# Altium project RS485 Gateway.PrjPcb
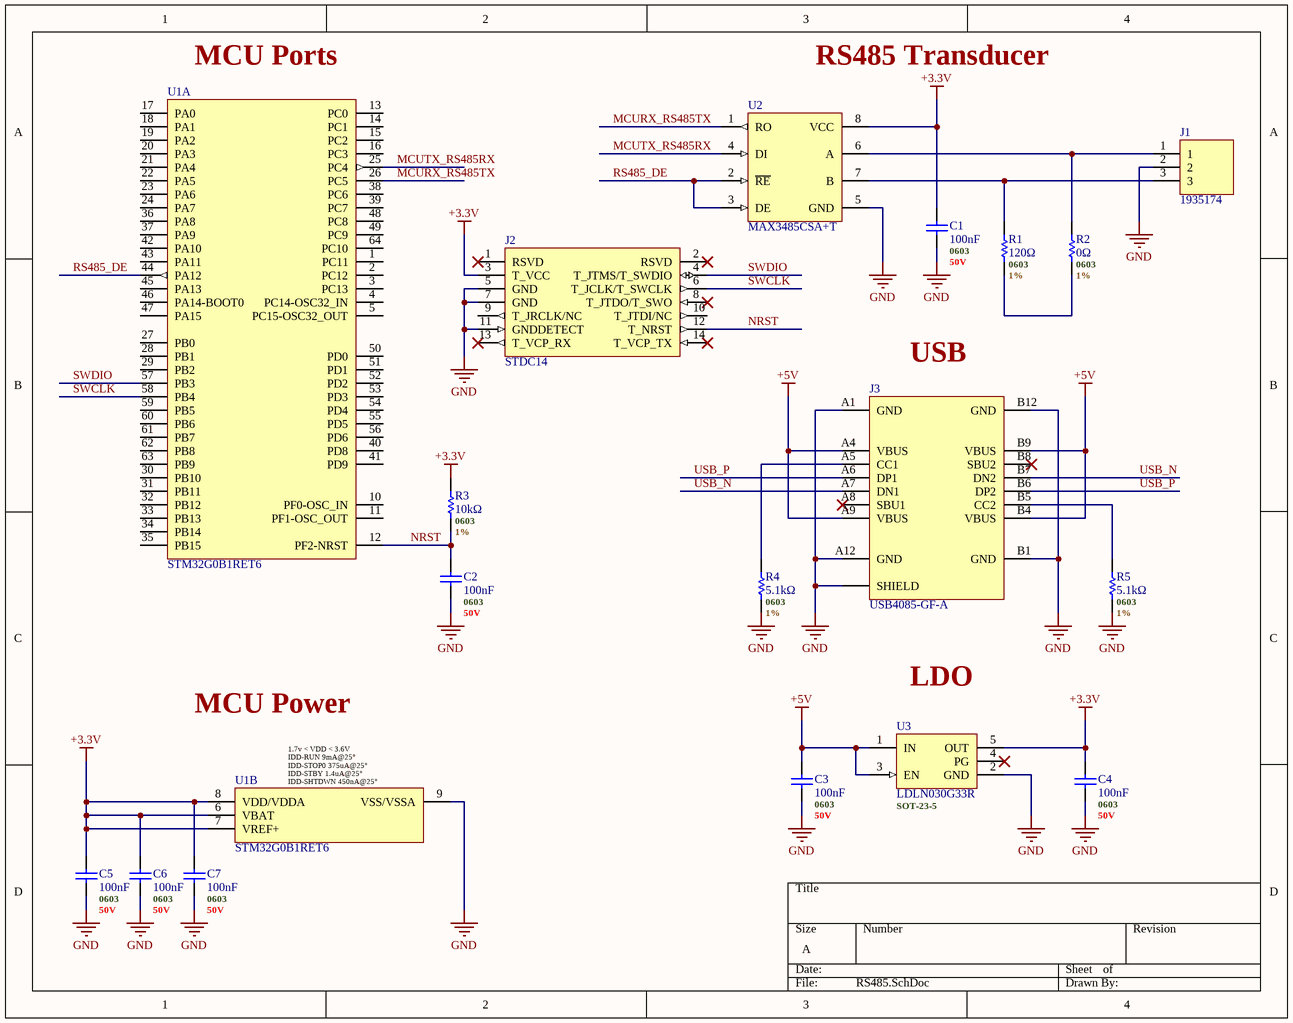
[diagram p0: RS485.SchDoc]
1 sheet, 18 parts. Net scope: global (net labels, ports and power ports of the same name join across sheets).
Board file: PCB2.PcbDoc

## Sheet RS485.SchDoc
size A; SheetNumber: 1; SheetTotal: 1

### Parts
C1  100nF  .Case/Package: 0603  .Rated DC Voltage (URdc): 50V  [C0402 - MURATA]
C2  100nF  .Case/Package: 0603  .Rated DC Voltage (URdc): 50V  [C0402 - MURATA]
C3  100nF  .Case/Package: 0603  .Rated DC Voltage (URdc): 50V  [C0402 - MURATA]
C4  100nF  .Case/Package: 0603  .Rated DC Voltage (URdc): 50V  [C0402 - MURATA]
C5  100nF  .Case/Package: 0603  .Rated DC Voltage (URdc): 50V  [C0402 - MURATA]
C6  100nF  .Case/Package: 0603  .Rated DC Voltage (URdc): 50V  [C0402 - MURATA]
C7  100nF  .Case/Package: 0603  .Rated DC Voltage (URdc): 50V  [C0402 - MURATA]
J1  1935174  [1935174 - PHOENIX]
J2  STDC14  [FTSH-107-01-L-DV-K-P-TR]
J3  USB4085-GF-A  [USB4085-GF-A - GCT - 071422]
R1  120Ω  .Case/Package: 0603  .Tolerance: 1%  [R0603 - YAGEO]
R2  0Ω  .Case/Package: 0603  .Tolerance: 1%  [R0603 - YAGEO]
R3  10kΩ  .Case/Package: 0603  .Tolerance: 1%  [R0603 - YAGEO]
R4  5.1kΩ  .Case/Package: 0603  .Tolerance: 1%  [R0603 - YAGEO]
R5  5.1kΩ  .Case/Package: 0603  .Tolerance: 1%  [R0603 - YAGEO]
U1  STM32G0B1RET6  [64-LQFP - STM]  (parts A,B of 2)
U2  MAX3485CSA+T  [8-SOIC - ANALOG]
U3  LDLN030G33R  .Case/Package: SOT-23-5  [TSOT-23-5 - STM]

### Nets
+3.3V: C1.2 C4.2 C5.2 C6.2 C7.2 J2.3(T_VCC) R3.2 U1.6(VBAT) U1.7(VREF+) U1.8(VDD/VDDA) U2.8(VCC) U3.5(OUT)
+5V: C3.2 J3.A4(VBUS) J3.A9(VBUS) J3.B4(VBUS) J3.B9(VBUS) U3.1(IN) U3.3(EN)
GND: C1.1 C2.1 C3.1 C4.1 C5.1 C6.1 C7.1 J1.2 J2.5(GND) J2.7(GND) J2.11(GNDDETECT) J3.A1(GND) J3.A12(GND) J3.B1(GND) J3.B12(GND) J3.SHIELD R4.1 R5.1 U1.9(VSS/VSSA) U2.5(GND) U3.2(GND)
MCURX_RS485TX: U1.26(PC5) U2.1(RO)
MCUTX_RS485RX: U1.25(PC4) U2.4(DI)
NRST: C2.2 J2.12(T_NRST) R3.1 U1.12(PF2-NRST)
RS485_DE: U1.44(PA12) U2.2(~{RE}) U2.3(DE)
SWCLK: J2.6(T_JCLK/T_SWCLK) U1.58(PB4)
SWDIO: J2.4(T_JTMS/T_SWDIO) U1.57(PB3)
USB_N: J3.A7(DN1) J3.B7(DN2)
USB_P: J3.A6(DP1) J3.B6(DP2)
NetJ1_1: J1.1 R2.2 U2.6(A)
NetJ1_3: J1.3 R1.2 U2.7(B)
NetJ3_A5: J3.A5(CC1) R4.2
NetJ3_B5: J3.B5(CC2) R5.2
NetR1_1: R1.1 R2.1

Not connected (* = marked no-connect by the designer): J2 1(RSVD)* 2(RSVD)* 8(T_JTDO/T_SWO)* 9(T_JRCLK/NC) 10(T_JTDI/NC) 13(T_VCP_RX)* 14(T_VCP_TX)*; J3 A8(SBU1)* B8(SBU2)*; U1 1(PC11) 2(PC12) 3(PC13) 4(PC14-OSC32_IN) 5(PC15-OSC32_OUT) 10(PF0-OSC_IN) 11(PF1-OSC_OUT) 13(PC0) 14(PC1) 15(PC2) 16(PC3) 17(PA0) 18(PA1) 19(PA2) 20(PA3) 21(PA4) 22(PA5) 23(PA6) 24(PA7) 27(PB0) 28(PB1) 29(PB2) 30(PB10) 31(PB11) 32(PB12) 33(PB13) 34(PB14) 35(PB15) 36(PA8) 37(PA9) 38(PC6) 39(PC7) 40(PD8) 41(PD9) 42(PA10) 43(PA11) 45(PA13) 46(PA14-BOOT0) 47(PA15) 48(PC8) 49(PC9) 50(PD0) 51(PD1) 52(PD2) 53(PD3) 54(PD4) 55(PD5) 56(PD6) 59(PB5) 60(PB6) 61(PB7) 62(PB8) 63(PB9) 64(PC10); U3 4(PG)*

### Notes on the sheet
- (near U1) MCU Ports
- RS485 Transducer
- (near J3) USB
- LDO
- MCU Power
- (in symbol STM32G0B1RET6, part B) 1.7v < VDD < 3.6V / IDD-RUN 9mA@25° / IDD-STOP0 375uA@25° / IDD-STBY 1.4uA@25° / IDD-SHTDWN 450nA@25°

### Library data of the parts
C1-C7 = CAP - GENERIC: Cap Ceramic 0.1uF 50V X7R 10% Pad SMD 0603 Soft Termination 125C Automotive T/R; Manufacturer: Murata; Manufacturer Part Number: GCJ188R71H104KA12D; Manufacturer Lifecycle Status: IN PRODUCTION; .Date: 050525; Supplier: Avnet; Supplier Part Number: GCJ188R71H104KA12D; RoHS: Compliant; Category: Ceramic Capacitors; Stock: 204000; Pricing: 4000=0.01499 (USD); Value: 100nF; Case/Package: 0603; Case Code (Imperial): 0603; Case Code (Metric): 1608; Depth: 800µm; Dielectric: X7R; Dielectric Material: Ceramic; Features: Soft Termination; Height: 800µm; Lead Free: Lead Free; Length: 1.6mm; Lifecycle Status: Production; Material: Ceramic; Max Operating Temperature: 125°C; Min Operating Temperature: -55°C; Mounting Technology: Surface Mount; Number of Terminals: 2; Packaging: Cut Tape; Radiation Hardening: No; Ratings: AEC-Q200; REACH SVHC: Yes; Schedule B: 8532240020, 8532240020|8532240020, 8532240020|8532240020|8532240020, 8532240020|8532240020|8532240020|8532240020; Termination: SMD/SMT; Tolerance: 10%; Voltage Rating: 50V; Voltage Rating (DC): 50V; Width: 800µm; ComponentLink1URL: https://datasheet.octopart.com:443/GCJ188R71H104KA12D-Murata-datasheet-68586835.pdf?src-supplier=Newark; ComponentLink1Description: https://datasheet.octopart.com:443/GCJ188R71H104KA12D-Murata-datasheet-68586835.pdf?src-supplier=Newark; ComponentLink2URL: https://datasheet.octopart.com:443/GCJ188R71H104KA12D-Murata-datasheet-140654765.pdf?src-supplier=Ciiva; ComponentLink2Description: https://datasheet.octopart.com:443/GCJ188R71H104KA12D-Murata-datasheet-140654765.pdf?src-supplier=Ciiva; ComponentLink3URL: https://datasheet.octopart.com:443/GCJ188R71H104KA12D-Murata-datasheet-138714437.pdf?src-supplier=Ciiva; ComponentLink3Description: https://datasheet.octopart.com:443/GCJ188R71H104KA12D-Murata-datasheet-138714437.pdf?src-supplier=Ciiva; ComponentLink4URL: https://datasheet.octopart.com:443/GCJ188R71H104KA12D-Murata-datasheet-165611796.pdf?src-supplier=TME; ComponentLink4Description: https://datasheet.octopart.com:443/GCJ188R71H104KA12D-Murata-datasheet-165611796.pdf?src-supplier=TME; ComponentLink5URL: https://datasheet.octopart.com:443/GCJ188R71H104KA12D-Murata-datasheet-12524712.pdf?src-supplier=Future+Electronics; ComponentLink5Description: https://datasheet.octopart.com:443/GCJ188R71H104KA12D-Murata-datasheet-12524712.pdf?src-supplier=Future+Electronics; ComponentLink6URL: https://datasheet.octopart.com/GCJ188R71H104KA12D-Murata-datasheet-14405607.pdf; ComponentLink6Description: https://datasheet.octopart.com/GCJ188R71H104KA12D-Murata-datasheet-14405607.pdf; ComponentLink7URL: http://sigma.octopart.com:80/reach_statement/Murata-company-16.pdf?src-supplier=Compliance+Statements; ComponentLink7Description: http://sigma.octopart.com:80/reach_statement/Murata-company-16.pdf?src-supplier=Compliance+Statements; Supplier 1: DigiKey; Supplier Part Number 1: 490-5798-6-ND
J1 = CONN 1X3: Terminal Block; Printed Circuit; 16 A; 250 V; 5 mm; 3; 5 mm; Soldering Mount; Manufacturer: Phoenix Contact; Approvals: UL; Current: 18A; Current Rating: 17.5A; Max Current Rating: 16A; Max Supply Voltage: 250V; Number of Circuits: 3; Number of Levels: 1; Pitch: 5mm; Voltage: 300V; Voltage Rating (DC): 320V; Wire/Cable Gauge: 14AWG; Wire Gauge (Max): 26AWG; Wire Gauge (Min): 12AWG; Supplier: RS (Formerly Allied Electronics); Supplier Part Number: 70054333; Manufacturer Part Number: 1935174; RoHS: Compliant; Category: Terminal Blocks; Stock: 132; Pricing: 1=0.74 (USD); Ambient Temperature Range High: 100°C; China RoHS: Non-Compliant; Color: Green; Contact Material: Nickel, Tin; Contact Plating: Tin; Depth: 9mm; Flammability Rating: UL94 V-0; Height: 11.55mm; Housing Color: Green; Insulation Material: Nylon; Lead Free: Lead Free; Length: 9mm; Lifecycle Status: Production; Material: Nylon; Max Operating Temperature: 100°C; Min Operating Temperature: -40°C; Mounting Technology: Screw; Number of Contacts: 3; Pins: 3; Number of Poles: 3; Number of Positions: 3; Number of Positions Per Level: 3; Number of Rows: 1; Orientation: Straight; Radiation Hardening: No; REACH SVHC: No; Stripping Length: 5mm; Termination: Solder; Thickness: 10mm; Voltage Rating: 250V; Weight: 2.850006g; Width: 15mm; ComponentLink1URL: https://datasheet.octopart.com:443/1935174-Phoenix-Contact-datasheet-181093233.pdf?src-supplier=IHS; ComponentLink1Description: https://datasheet.octopart.com:443/1935174-Phoenix-Contact-datasheet-181093233.pdf?src-supplier=IHS; ComponentLink2URL: https://datasheet.octopart.com:443/1935174-Phoenix-Contact-datasheet-86451116.pdf?src-supplier=Farnell; ComponentLink2Description: https://datasheet.octopart.com:443/1935174-Phoenix-Contact-datasheet-86451116.pdf?src-supplier=Farnell; ComponentLink3URL: https://datasheet.octopart.com:443/PT1%2C5/3-5.0-H-Phoenix-Contact-datasheet-8825747.pdf?src-supplier=element14+APAC; ComponentLink3Description: https://datasheet.octopart.com:443/PT1%2C5/3-5.0-H-Phoenix-Contact-datasheet-8825747.pdf?src-supplier=element14+APAC; ComponentLink4URL: https://datasheet.octopart.com:443/1935174-Phoenix-Contact-datasheet-154783735.pdf?src-supplier=Electro+Sonic; ComponentLink4Description: https://datasheet.octopart.com:443/1935174-Phoenix-Contact-datasheet-154783735.pdf?src-supplier=Electro+Sonic; ComponentLink5URL: https://datasheet.octopart.com:443/1935174-Phoenix-Contact-datasheet-62123024.pdf?src-supplier=RS+(Formerly+Allied+Electronics); ComponentLink5Description: https://datasheet.octopart.com:443/1935174-Phoenix-Contact-datasheet-62123024.pdf?src-supplier=RS+(Formerly+Allied+Electronics); ComponentLink6URL: https://datasheet.octopart.com:443/1935174-Phoenix-Contact-datasheet-9933183.pdf?src-supplier=RS+(Formerly+Allied+Electronics); ComponentLink6Description: https://datasheet.octopart.com:443/1935174-Phoenix-Contact-datasheet-9933183.pdf?src-supplier=RS+(Formerly+Allied+Electronics); ComponentLink7URL: https://datasheet.octopart.com:443/1935174-Phoenix-Contact-datasheet-72435.pdf?src-supplier=RS+(Formerly+Allied+Electronics); ComponentLink7Description: https://datasheet.octopart.com:443/1935174-Phoenix-Contact-datasheet-72435.pdf?src-supplier=RS+(Formerly+Allied+Electronics); ComponentLink8URL: https://datasheet.octopart.com:443/1935174-Phoenix-Contact-datasheet-33522581.pdf?src-supplier=MRO+Stop; ComponentLink8Description: https://datasheet.octopart.com:443/1935174-Phoenix-Contact-datasheet-33522581.pdf?src-supplier=MRO+Stop; ComponentLink9URL: https://datasheet.octopart.com:443/1935174-Phoenix-Contact-datasheet-54829.pdf?src-supplier=DigiKey; ComponentLink9Description: https://datasheet.octopart.com:443/1935174-Phoenix-Contact-datasheet-54829.pdf?src-supplier=DigiKey; ComponentLink10URL: https://datasheet.octopart.com:443/1935174-Phoenix-Contact-datasheet-164875068.pdf?src-supplier=Burklin+Elektronik; ComponentLink10Description: https://datasheet.octopart.com:443/1935174-Phoenix-Contact-datasheet-164875068.pdf?src-supplier=Burklin+Elektronik; Supplier 1: DigiKey; Supplier Part Number 1: 277-1578-ND
J2 = STDC14: Manufacturer: Samtec; Number of Contacts: 14; Gender: Male; Pitch: 1.27mm; Manufacturer Part Number: FTSH-107-01-L-DV-K-P-TR; RoHS: Yes; Category: Headers and Wire Housings; Stock 1: 404; Pricing 1: 1=4.81000, 10=4.62000, 100=3.85000 (USD); Contact Plating: Gold; Housing Material: Polymer; Housing Color: Black; Contact Material: Bronze; Min Operating Temperature: -55°C; Max Operating Temperature: 125°C; Termination: Solder; Number of Rows: 2; Orientation: Straight; Packaging: Tape and Reel; Length: 8.89mm; Depth: 3.43mm; Radiation Hardening: No; Lead Free: Lead Free; Supplier 1: DigiKey; Supplier Part Number 1: SAM13946CT-ND
J3 = USB4085-GF-A: USB4085 Series 20 V PCB Top Mount USB 2.0 Type C Receptacle; Manufacturer: Global Connector Technology; USB Standard: USB 2.0; Number of Positions: 16; Supplier 1: Digi-Key; Supplier Part Number 1: 2073-USB4085-GF-ACT-ND; Manufacturer Part Number: USB4085-GF-A; RoHS: Yes; Category: USB Connectors; Stock 1: 30576; Contact Material: Copper Alloy; Contact Plating: Gold; Gender: Receptacle; Orientation: Right Angle; ComponentLink1URL: https://datasheet.ciiva.com/71788/2674755-71788146.pdf?src-supplier=Element14; ComponentLink1Description: https://datasheet.ciiva.com/71788/2674755-71788146.pdf?src-supplier=Element14; ComponentLink2URL: https://datasheet.ciiva.com/71788/usb4085-71788147.pdf?src-supplier=Digi-Key; ComponentLink2Description: https://datasheet.ciiva.com/71788/usb4085-71788147.pdf?src-supplier=Digi-Key
R1 = RESISTOR - GENERIC: Res Thick Film 0603 120 Ohm 1% 0.1W(1/10W) ±100ppm/C Pad SMD T/R; Manufacturer: Yageo Group; Manufacturer Part Number: RC0603FR-10120RL; Power Dissipation: 100mW; Temperature Coefficient: 100ppm/°C; Voltage Rating: 50V; Working Voltage: 75V; Supplier: Newark; Supplier Part Number: 47AK3870; RoHS: Compliant; Category: Chip SMD Resistors; Stock: 7940; Pricing: 10=0.010, 25=0.009, 50=0.009, 100=0.008, 500=0.007, 1000=0.006, 5000=0.005 (USD); Case/Package: 0603; Case Code (Imperial): 0603; Case Code (Metric): 1608; China RoHS: Non-Compliant; Composition: Thick Film; Contact Plating: Tin; Depth: 800µm; Height: 450µm; Length: 1.6mm; Lifecycle Status: Production; Max Operating Temperature: 155°C; Military Standard: Not; Min Operating Temperature: -55°C; Mounting Technology: Surface Mount; Number of Terminals: 2; Power Rating: 100mW; Radiation Hardening: No; REACH SVHC: Yes; Value: 120Ω; Termination: SMD/SMT; Tolerance: 1%; Width: 800µm; ComponentLink1URL: https://datasheet.octopart.com:443/RC0603FR-10120RL-Yageo-datasheet-175887523.pdf?src-supplier=IHS; ComponentLink1Description: https://datasheet.octopart.com:443/RC0603FR-10120RL-Yageo-datasheet-175887523.pdf?src-supplier=IHS; ComponentLink2URL: https://datasheet.octopart.com:443/RC0603FR-10120RL-Yageo-datasheet-164759695.pdf?src-supplier=Future+Electronics; ComponentLink2Description: https://datasheet.octopart.com:443/RC0603FR-10120RL-Yageo-datasheet-164759695.pdf?src-supplier=Future+Electronics; ComponentLink3URL: https://datasheet.octopart.com:443/RC0603FR-10120RL-Yageo-datasheet-137700087.pdf?src-supplier=Future+Electronics; ComponentLink3Description: https://datasheet.octopart.com:443/RC0603FR-10120RL-Yageo-datasheet-137700087.pdf?src-supplier=Future+Electronics; ComponentLink4URL: https://datasheet.octopart.com/RC0603FR-10120RL-Yageo-datasheet-73766026.pdf; ComponentLink4Description: https://datasheet.octopart.com/RC0603FR-10120RL-Yageo-datasheet-73766026.pdf; ComponentLink5URL: https://datasheet.octopart.com:443/RC0603FR-10120RL-Yageo-datasheet-8328172.pdf?src-supplier=_legacy+Avnet; ComponentLink5Description: https://datasheet.octopart.com:443/RC0603FR-10120RL-Yageo-datasheet-8328172.pdf?src-supplier=_legacy+Avnet; ComponentLink6URL: http://sigma.octopart.com:80/conflict_mineral_statement/Yageo-company-3.pdf?src-supplier=Compliance+Statements; ComponentLink6Description: http://sigma.octopart.com:80/conflict_mineral_statement/Yageo-company-3.pdf?src-supplier=Compliance+Statements; ComponentLink7URL: http://sigma.octopart.com:80/rohs_statement/Yageo-company-2.pdf?src-supplier=Compliance+Statements; ComponentLink7Description: http://sigma.octopart.com:80/rohs_statement/Yageo-company-2.pdf?src-supplier=Compliance+Statements; Supplier 1: Newark; Supplier Part Number 1: 47AK3870
R2 = RESISTOR - GENERIC: GENERAL PURPOSE CHIP RESISTOR Metal Glaze/thick Film, 0.1W, 0ohm, Surface Mount, 0603; Manufacturer: Yageo Group; Manufacturer Part Number: RC0603JR-070RL; Power Dissipation: 100mW; Temperature Coefficient: 200ppm/°C; Voltage Rating: 50V; .Date: 050325; Supplier: Avnet; Supplier Part Number: RC0603JR-070RL; RoHS: Compliant; Category: Chip SMD Resistors; Stock: 1110000; Pricing: 5000=0.00139, 10000=0.00135, 20000=0.00131, 30000=0.00129, 40000=0.00126 (USD); Case/Package: 0603; Case Code (Imperial): 0603; China RoHS: Non-Compliant; Composition: Thick Film; Contact Plating: Tin; Depth: 800µm; Height: 450µm; Lead Free: Lead Free; Length: 1.6mm; Lifecycle Status: Production; Max Operating Temperature: 155°C; Military Standard: Not; Min Operating Temperature: -55°C; Mounting Technology: Surface Mount; Pins: 2; Number of Terminals: 2; Packaging: Cut Tape; Power Rating: 100mW; Radiation Hardening: No; REACH SVHC: Yes; Value: 0Ω; Termination: SMD/SMT; Tolerance: 1%; Voltage Rating (DC): 50V; Width: 800µm; ComponentLink1URL: https://datasheet.octopart.com:443/RC0603JR-070RL-Yageo-datasheet-182189538.pdf?src-supplier=IHS; ComponentLink1Description: https://datasheet.octopart.com:443/RC0603JR-070RL-Yageo-datasheet-182189538.pdf?src-supplier=IHS; ComponentLink2URL: https://datasheet.octopart.com:443/RC0603JR-070RL-Yageo-datasheet-8328172.pdf?src-supplier=element14+APAC; ComponentLink2Description: https://datasheet.octopart.com:443/RC0603JR-070RL-Yageo-datasheet-8328172.pdf?src-supplier=element14+APAC; ComponentLink3URL: https://datasheet.octopart.com:443/RC0603JR-070RL-Yageo-datasheet-17842380.pdf?src-supplier=element14+APAC; ComponentLink3Description: https://datasheet.octopart.com:443/RC0603JR-070RL-Yageo-datasheet-17842380.pdf?src-supplier=element14+APAC; ComponentLink4URL: https://datasheet.octopart.com:443/RC0603JR-070RL-Yageo-datasheet-62067350.pdf?src-supplier=Farnell; ComponentLink4Description: https://datasheet.octopart.com:443/RC0603JR-070RL-Yageo-datasheet-62067350.pdf?src-supplier=Farnell; ComponentLink5URL: https://datasheet.octopart.com:443/RC0603JR-070RL-Yageo-datasheet-15599030.pdf?src-supplier=Future+Electronics; ComponentLink5Description: https://datasheet.octopart.com:443/RC0603JR-070RL-Yageo-datasheet-15599030.pdf?src-supplier=Future+Electronics; ComponentLink6URL: https://datasheet.octopart.com:443/RC0603JR-070RL-Yageo-datasheet-164759695.pdf?src-supplier=Future+Electronics; ComponentLink6Description: https://datasheet.octopart.com:443/RC0603JR-070RL-Yageo-datasheet-164759695.pdf?src-supplier=Future+Electronics; ComponentLink7URL: https://datasheet.octopart.com:443/RC0603JR-070RL-Yageo-datasheet-137700087.pdf?src-supplier=Future+Electronics; ComponentLink7Description: https://datasheet.octopart.com:443/RC0603JR-070RL-Yageo-datasheet-137700087.pdf?src-supplier=Future+Electronics; ComponentLink8URL: https://datasheet.octopart.com:443/RC0603JR-070RL-Yageo-datasheet-27584510.pdf?src-supplier=Future+Electronics; ComponentLink8Description: https://datasheet.octopart.com:443/RC0603JR-070RL-Yageo-datasheet-27584510.pdf?src-supplier=Future+Electronics; ComponentLink9URL: https://datasheet.octopart.com:443/RC0603JR-070RL-Yageo-datasheet-503470.pdf?src-supplier=Future+Electronics; ComponentLink9Description: https://datasheet.octopart.com:443/RC0603JR-070RL-Yageo-datasheet-503470.pdf?src-supplier=Future+Electronics; ComponentLink10URL: https://datasheet.octopart.com:443/RC0603JR-070RL-Yageo-datasheet-12596169.pdf?src-supplier=Newark; ComponentLink10Description: https://datasheet.octopart.com:443/RC0603JR-070RL-Yageo-datasheet-12596169.pdf?src-supplier=Newark; ComponentLink11URL: https://datasheet.octopart.com:443/RC0603JR-070RL-Yageo-datasheet-34211833.pdf?src-supplier=Newark; ComponentLink11Description: https://datasheet.octopart.com:443/RC0603JR-070RL-Yageo-datasheet-34211833.pdf?src-supplier=Newark; ComponentLink12URL: https://datasheet.octopart.com:443/RC0603JR-070RL-Yageo-datasheet-79472498.pdf?src-supplier=Megastar; ComponentLink12Description: https://datasheet.octopart.com:443/RC0603JR-070RL-Yageo-datasheet-79472498.pdf?src-supplier=Megastar; ComponentLink13URL: https://datasheet.octopart.com/RC0603JR-070RL-Yageo-datasheet-73766026.pdf; ComponentLink13Description: https://datasheet.octopart.com/RC0603JR-070RL-Yageo-datasheet-73766026.pdf; ComponentLink14URL: https://datasheet.octopart.com:443/RC0603JR-070RL-Yageo-datasheet-5393049.pdf?src-supplier=element14; ComponentLink14Description: https://datasheet.octopart.com:443/RC0603JR-070RL-Yageo-datasheet-5393049.pdf?src-supplier=element14; ComponentLink15URL: https://datasheet.octopart.com:443/RC0603JR-070RL-Yageo-datasheet-118562.pdf?src-supplier=DigiKey; ComponentLink15Description: https://datasheet.octopart.com:443/RC0603JR-070RL-Yageo-datasheet-118562.pdf?src-supplier=DigiKey; ComponentLink16URL: http://sigma.octopart.com:80/rohs_statement/Yageo-company-2.pdf?src-supplier=Compliance+Statements; ComponentLink16Description: http://sigma.octopart.com:80/rohs_statement/Yageo-company-2.pdf?src-supplier=Compliance+Statements; ComponentLink17URL: http://sigma.octopart.com:80/conflict_mineral_statement/Yageo-company-3.pdf?src-supplier=Compliance+Statements; ComponentLink17Description: http://sigma.octopart.com:80/conflict_mineral_statement/Yageo-company-3.pdf?src-supplier=Compliance+Statements; Supplier 1: Avnet; Supplier Part Number 1: RC0603JR-070RL
R3 = RESISTOR - GENERIC: 100mW Thick Film Resistors 75V ±100ppm/℃ ±1% 10kΩ 0603 Chip Resistor - Surface Mount ROHS; Manufacturer: Yageo Group; Manufacturer Part Number: RC0603FR-0710KL; Temperature Coefficient: 100ppm/°C; Voltage Rating (DC): 50V; .Date: 050325; Supplier: Avnet; Supplier Part Number: RC0603FR-0710KL; RoHS: Compliant; Category: Chip SMD Resistors; Stock: 1130000; Pricing: 5000=0.00136, 10000=0.00132, 20000=0.00129, 30000=0.00126, 40000=0.00123 (USD); Case/Package: 0603; Case Code (Imperial): 0603; Case Code (Metric): 0603; China RoHS: Non-Compliant; Composition: Thick Film; Depth: 800µm; Height: 450µm; Lead Free: Lead Free; Lead Pitch: 300µm; Length: 1.6mm; Lifecycle Status: Production; Max Operating Temperature: 155°C; Military Standard: Not; Min Operating Temperature: -55°C; Mounting Technology: Surface Mount; Pins: 2; Number of Terminals: 2; Packaging: Tape & Reel; Power Dissipation: 100mW; Power Rating: 100mW; REACH SVHC: Yes; Value: 10kΩ; Schedule B: 8533210045, 8533210045|8533210045|8533210045|8533210045|8533210045|8533210045|8533210045|8533210045|8533210045|8533210045|8533210045|8533210045|8533210045|8533210045|8533210045|8533210045|8533210045|8533210045|8533210045|8533210045|8533210045|8533210045|8533210045|85; Termination: SMD/SMT; Tolerance: 1%; Voltage Rating: 75V; Weight: 2.012816mg; Width: 800µm; Working Voltage: 75V; ComponentLink1URL: https://datasheet.octopart.com:443/RC0603FR-0710KL-Yageo-datasheet-175887523.pdf?src-supplier=IHS; ComponentLink1Description: https://datasheet.octopart.com:443/RC0603FR-0710KL-Yageo-datasheet-175887523.pdf?src-supplier=IHS; ComponentLink2URL: https://datasheet.octopart.com:443/RC0603FR-0710KL-Yageo-datasheet-103092701.pdf?src-supplier=Upverter; ComponentLink2Description: https://datasheet.octopart.com:443/RC0603FR-0710KL-Yageo-datasheet-103092701.pdf?src-supplier=Upverter; ComponentLink3URL: https://datasheet.octopart.com:443/RC0603FR-0710KL-Yageo-datasheet-98239111.pdf?src-supplier=Upverter; ComponentLink3Description: https://datasheet.octopart.com:443/RC0603FR-0710KL-Yageo-datasheet-98239111.pdf?src-supplier=Upverter; ComponentLink4URL: https://datasheet.octopart.com:443/RC0603FR-0710KL-Yageo-datasheet-141265859.pdf?src-supplier=Upverter; ComponentLink4Description: https://datasheet.octopart.com:443/RC0603FR-0710KL-Yageo-datasheet-141265859.pdf?src-supplier=Upverter; ComponentLink5URL: https://sigma.octopart.com:443/138820526/technical_drawing/Yageo-RC0603FR-0710KL.pdf?src-supplier=Upverter; ComponentLink5Description: https://sigma.octopart.com:443/138820526/technical_drawing/Yageo-RC0603FR-0710KL.pdf?src-supplier=Upverter; ComponentLink6URL: https://datasheet.octopart.com:443/RC0603FR-0710KL-Yageo-datasheet-8328172.pdf?src-supplier=Farnell; ComponentLink6Description: https://datasheet.octopart.com:443/RC0603FR-0710KL-Yageo-datasheet-8328172.pdf?src-supplier=Farnell; ComponentLink7URL: https://datasheet.octopart.com:443/RC0603FR-0710KL-Yageo-datasheet-13691069.pdf?src-supplier=Farnell; ComponentLink7Description: https://datasheet.octopart.com:443/RC0603FR-0710KL-Yageo-datasheet-13691069.pdf?src-supplier=Farnell; ComponentLink8URL: https://datasheet.octopart.com:443/RC0603FR-0710KL-Yageo-datasheet-62067350.pdf?src-supplier=element14+APAC; ComponentLink8Description: https://datasheet.octopart.com:443/RC0603FR-0710KL-Yageo-datasheet-62067350.pdf?src-supplier=element14+APAC; ComponentLink9URL: https://datasheet.octopart.com:443/RC0603FR-0710KL-Yageo-datasheet-17842380.pdf?src-supplier=element14+APAC; ComponentLink9Description: https://datasheet.octopart.com:443/RC0603FR-0710KL-Yageo-datasheet-17842380.pdf?src-supplier=element14+APAC; ComponentLink10URL: https://datasheet.octopart.com:443/RC0603FR-0710KL-Yageo-datasheet-15599030.pdf?src-supplier=Future+Electronics; ComponentLink10Description: https://datasheet.octopart.com:443/RC0603FR-0710KL-Yageo-datasheet-15599030.pdf?src-supplier=Future+Electronics; ComponentLink11URL: https://datasheet.octopart.com:443/RC0603FR-0710KL-Yageo-datasheet-164759695.pdf?src-supplier=Future+Electronics; ComponentLink11Description: https://datasheet.octopart.com:443/RC0603FR-0710KL-Yageo-datasheet-164759695.pdf?src-supplier=Future+Electronics; ComponentLink12URL: https://datasheet.octopart.com:443/RC0603FR-0710KL-Yageo-datasheet-127823281.pdf?src-supplier=Future+Electronics; ComponentLink12Description: https://datasheet.octopart.com:443/RC0603FR-0710KL-Yageo-datasheet-127823281.pdf?src-supplier=Future+Electronics; ComponentLink13URL: https://datasheet.octopart.com:443/RC0603FR-0710KL-Yageo-datasheet-137700087.pdf?src-supplier=Future+Electronics; ComponentLink13Description: https://datasheet.octopart.com:443/RC0603FR-0710KL-Yageo-datasheet-137700087.pdf?src-supplier=Future+Electronics; ComponentLink14URL: https://datasheet.octopart.com:443/RC0603FR-0710KL-Yageo-datasheet-27584510.pdf?src-supplier=Future+Electronics; ComponentLink14Description: https://datasheet.octopart.com:443/RC0603FR-0710KL-Yageo-datasheet-27584510.pdf?src-supplier=Future+Electronics; ComponentLink15URL: https://datasheet.octopart.com:443/RC0603FR-0710KL-Yageo-datasheet-8324193.pdf?src-supplier=Future+Electronics; ComponentLink15Description: https://datasheet.octopart.com:443/RC0603FR-0710KL-Yageo-datasheet-8324193.pdf?src-supplier=Future+Electronics; ComponentLink16URL: https://datasheet.octopart.com:443/RC0603FR-0710KL-Yageo-datasheet-12596169.pdf?src-supplier=Newark; ComponentLink16Description: https://datasheet.octopart.com:443/RC0603FR-0710KL-Yageo-datasheet-12596169.pdf?src-supplier=Newark; ComponentLink17URL: https://datasheet.octopart.com:443/RC0603FR-0710KL-Yageo-datasheet-503470.pdf?src-supplier=Newark; ComponentLink17Description: https://datasheet.octopart.com:443/RC0603FR-0710KL-Yageo-datasheet-503470.pdf?src-supplier=Newark; ComponentLink18URL: https://datasheet.octopart.com:443/RC0603FR-0710KL-Yageo-datasheet-34211833.pdf?src-supplier=Newark; ComponentLink18Description: https://datasheet.octopart.com:443/RC0603FR-0710KL-Yageo-datasheet-34211833.pdf?src-supplier=Newark; ComponentLink19URL: https://datasheet.octopart.com:443/RC0603FR-0710KL-Yageo-datasheet-79472498.pdf?src-supplier=Megastar; ComponentLink19Description: https://datasheet.octopart.com:443/RC0603FR-0710KL-Yageo-datasheet-79472498.pdf?src-supplier=Megastar; ComponentLink20URL: https://datasheet.octopart.com/RC0603FR-0710KL-Yageo-datasheet-73766026.pdf; ComponentLink20Description: https://datasheet.octopart.com/RC0603FR-0710KL-Yageo-datasheet-73766026.pdf; ComponentLink21URL: https://datasheet.octopart.com:443/RC0603FR-0710KL-Yageo-datasheet-118562.pdf?src-supplier=DigiKey; ComponentLink21Description: https://datasheet.octopart.com:443/RC0603FR-0710KL-Yageo-datasheet-118562.pdf?src-supplier=DigiKey; ComponentLink22URL: http://sigma.octopart.com:80/conflict_mineral_statement/Yageo-company-3.pdf?src-supplier=Compliance+Statements; ComponentLink22Description: http://sigma.octopart.com:80/conflict_mineral_statement/Yageo-company-3.pdf?src-supplier=Compliance+Statements; ComponentLink23URL: http://sigma.octopart.com:80/rohs_statement/Yageo-company-2.pdf?src-supplier=Compliance+Statements; ComponentLink23Description: http://sigma.octopart.com:80/rohs_statement/Yageo-company-2.pdf?src-supplier=Compliance+Statements
R4 R5 = RESISTOR - GENERIC: Res Thick Film 0603 5.1K Ohm 1% 0.1W(1/10W) ±100ppm/C Pad SMD T/R; Manufacturer: Yageo Group; Manufacturer Part Number: RC0603FR-075K1L; Max Power Dissipation: 100mW; Temperature Coefficient: 100ppm/°C; Voltage Rating: 75V; Voltage Rating (DC): 50V; .Date: 050325; Supplier: Avnet; Supplier Part Number: RC0603FR-075K1L; RoHS: Compliant; Category: Chip SMD Resistors; Stock: 795000; Pricing: 5000=0.00112, 10000=0.00111, 20000=0.00109, 30000=0.00107, 40000=0.00105 (USD); Case/Package: 0603; Case Code (Imperial): 0603; China RoHS: Non-Compliant; Composition: Thick Film; Depth: 800µm; Features: Moisture Resistant; Height: 450µm; Lead Free: Lead Free; Lifecycle Status: Production; Max Operating Temperature: 155°C; Military Standard: Not; Min Operating Temperature: -55°C; Mounting Technology: Surface Mount; Pins: 2; Number of Terminals: 2; Number of Terminations: 2; Packaging: Tape & Reel; Power Dissipation: 100mW; Power Rating: 100mW; REACH SVHC: Yes; Value: 5.1kΩ; Schedule B: 8533210045, 8533210045|8533210045, 8533210045|8533210045|8533210045, 8533210045|8533210045|8533210045|8533210045; Termination: SMD/SMT; Tolerance: 1%; Width: 800µm; Working Voltage: 75V; ComponentLink1URL: https://datasheet.octopart.com:443/RC0603FR-075K1L-Yageo-datasheet-175887523.pdf?src-supplier=IHS; ComponentLink1Description: https://datasheet.octopart.com:443/RC0603FR-075K1L-Yageo-datasheet-175887523.pdf?src-supplier=IHS; ComponentLink2URL: https://datasheet.octopart.com:443/RC0603FR-075K1L-Yageo-datasheet-103092701.pdf?src-supplier=Upverter; ComponentLink2Description: https://datasheet.octopart.com:443/RC0603FR-075K1L-Yageo-datasheet-103092701.pdf?src-supplier=Upverter; ComponentLink3URL: https://datasheet.octopart.com:443/RC0603FR-075K1L-Yageo-datasheet-8328172.pdf?src-supplier=Farnell; ComponentLink3Description: https://datasheet.octopart.com:443/RC0603FR-075K1L-Yageo-datasheet-8328172.pdf?src-supplier=Farnell; ComponentLink4URL: https://datasheet.octopart.com:443/RC0603FR-075K1L-Yageo-datasheet-62067350.pdf?src-supplier=Farnell; ComponentLink4Description: https://datasheet.octopart.com:443/RC0603FR-075K1L-Yageo-datasheet-62067350.pdf?src-supplier=Farnell; ComponentLink5URL: https://datasheet.octopart.com:443/RC0603FR-075K1L-Yageo-datasheet-34211833.pdf?src-supplier=element14+APAC; ComponentLink5Description: https://datasheet.octopart.com:443/RC0603FR-075K1L-Yageo-datasheet-34211833.pdf?src-supplier=element14+APAC; ComponentLink6URL: https://datasheet.octopart.com:443/RC0603FR-075K1L-Yageo-datasheet-164759695.pdf?src-supplier=Future+Electronics; ComponentLink6Description: https://datasheet.octopart.com:443/RC0603FR-075K1L-Yageo-datasheet-164759695.pdf?src-supplier=Future+Electronics; ComponentLink7URL: https://datasheet.octopart.com:443/RC0603FR-075K1L-Yageo-datasheet-137700087.pdf?src-supplier=Future+Electronics; ComponentLink7Description: https://datasheet.octopart.com:443/RC0603FR-075K1L-Yageo-datasheet-137700087.pdf?src-supplier=Future+Electronics; ComponentLink8URL: https://datasheet.octopart.com:443/RC0603FR-075K1L-Yageo-datasheet-15599030.pdf?src-supplier=Future+Electronics; ComponentLink8Description: https://datasheet.octopart.com:443/RC0603FR-075K1L-Yageo-datasheet-15599030.pdf?src-supplier=Future+Electronics; ComponentLink9URL: https://datasheet.octopart.com:443/RC0603FR-075K1L-Yageo-datasheet-12596169.pdf?src-supplier=Future+Electronics; ComponentLink9Description: https://datasheet.octopart.com:443/RC0603FR-075K1L-Yageo-datasheet-12596169.pdf?src-supplier=Future+Electronics; ComponentLink10URL: https://datasheet.octopart.com:443/RC0603FR-075K1L-Yageo-datasheet-503470.pdf?src-supplier=Future+Electronics; ComponentLink10Description: https://datasheet.octopart.com:443/RC0603FR-075K1L-Yageo-datasheet-503470.pdf?src-supplier=Future+Electronics; ComponentLink11URL: https://datasheet.octopart.com:443/RC0603FR-075K1L-Yageo-datasheet-148775077.pdf?src-supplier=TME; ComponentLink11Description: https://datasheet.octopart.com:443/RC0603FR-075K1L-Yageo-datasheet-148775077.pdf?src-supplier=TME; ComponentLink12URL: https://datasheet.octopart.com:443/RC0603FR-075K1L-Yageo-datasheet-79472498.pdf?src-supplier=Megastar; ComponentLink12Description: https://datasheet.octopart.com:443/RC0603FR-075K1L-Yageo-datasheet-79472498.pdf?src-supplier=Megastar; ComponentLink13URL: https://datasheet.octopart.com/RC0603FR-075K1L-Yageo-datasheet-73766026.pdf; ComponentLink13Description: https://datasheet.octopart.com/RC0603FR-075K1L-Yageo-datasheet-73766026.pdf; ComponentLink14URL: https://datasheet.octopart.com:443/RC0603FR-075K1L-Yageo-datasheet-118562.pdf?src-supplier=DigiKey; ComponentLink14Description: https://datasheet.octopart.com:443/RC0603FR-075K1L-Yageo-datasheet-118562.pdf?src-supplier=DigiKey; ComponentLink15URL: http://sigma.octopart.com:80/conflict_mineral_statement/Yageo-company-3.pdf?src-supplier=Compliance+Statements; ComponentLink15Description: http://sigma.octopart.com:80/conflict_mineral_statement/Yageo-company-3.pdf?src-supplier=Compliance+Statements; ComponentLink16URL: http://sigma.octopart.com:80/rohs_statement/Yageo-company-2.pdf?src-supplier=Compliance+Statements; ComponentLink16Description: http://sigma.octopart.com:80/rohs_statement/Yageo-company-2.pdf?src-supplier=Compliance+Statements; Supplier 1: Avnet; Supplier Part Number 1: RC0603FR-075K1L
U1 = STM32G0B1RET6: RISC Microcontroller, 32-Bit, FLASH, CORTEX-M0 CPU, 64MHz, CMOS, PQFP64; Manufacturer: STMicroelectronics; Manufacturer Part Number: STM32G0B1RET6; RoHS: Yes; Category: Microcontrollers; Stock: 882; Pricing: 1=5.08, 10=3.88, 50=3.58, 100=3.16, 1000=2.82, 10000=2.77 (USD); Supplier 1: Avnet; Supplier Part Number 1: 27AJ9873
U2 = MAX3485CSA+T: EAR99 MAX3485 Tape & Reel (TR) RS422RS485 interface transceiver 3.3V 0.000002A 4.9mm 22ns; Manufacturer: Analog Devices; Manufacturer Lifecycle Status: PRODUCTION; Data Rate: 10Mbps; ESD Protection: No; Interface: RS-422, RS-485; Max Power Dissipation: 727mW; Max Supply Voltage: 3.6V; Min Supply Voltage: 3V; Nominal Supply Current: 1mA; Number of Drivers: 1; Output Current: 60mA; Output Voltage: 12.5V; Receiver Hysteresis: 50mV; Simplex/Duplex: Half Duplex; Supplier: Newark; Supplier Part Number: 73Y3661; Manufacturer Part Number: MAX3485CSA+T; RoHS: Compliant; Category: Buffers, Drivers and Transceivers; Stock: 2441; Pricing: 1=5.64, 10=4.31, 25=3.98, 50=3.8, 100=3.62, 250=3.45, 500=3.34, 1000=3.25 (USD); Case/Package: SOIC; Contact Plating: Tin; Lifecycle Status: Production; Logic Function: Transceiver; Max Operating Temperature: 70°C; Min Operating Temperature: 0°C; Mounting Technology: Surface Mount; Pins: 8; Number of Receivers: 1; Number of Transceivers: 1; Number of Transmitters: 1; Operating Supply Voltage: 3.3V; Propagation Delay: 22ns; Radiation Hardening: No; REACH SVHC: Unknown; Schedule B: 8542390000|8542390000|8542390000|8542390000|8542390000; ComponentLink1URL: https://octopart.com:443/opatz8j6/c1?t=mIqTuXhyAOvopapMepZOtricAFJLsG1ilhiLLN3PJrzPCzzgDS_JdIbOjtOqNE6alWQjS5ySvodu03orj1JKOkXVdv_grbphuPVP8nY8JYJbLM8nXuQW6VP8M_QxKEEqkXvk2djVqMtDU22R3Wc-pj4iBbqxgJpNJwVh_vdWVB3WBjB-JxoFI04y-uQFDYvAN0krgXh55zNHEoPugH6OLChFiy050BSakhPJAjUXiADyCM7szf8axjTA73M90wcWW7mOZ0oTwYTIn9hEiEt3iI17nZq30F9Vuoy_3wyEJJKVQRfQUs5WxzJo&src-supplier=Analog+Devices; ComponentLink1Description: https://octopart.com:443/opatz8j6/c1?t=mIqTuXhyAOvopapMepZOtricAFJLsG1ilhiLLN3PJrzPCzzgDS_JdIbOjtOqNE6alWQjS5ySvodu03orj1JKOkXVdv_grbphuPVP8nY8JYJbLM8nXuQW6VP8M_QxKEEqkXvk2djVqMtDU22R3Wc-pj4iBbqxgJpNJwVh_vdWVB3WBjB-JxoFI04y-uQFDYvAN0krgXh55zNHEoPugH6OLChFiy050BSakhPJAjUXiADyCM7szf8axjTA73M90wcWW7mOZ0oTwYTIn9hEiEt3iI17nZq30F9Vuoy_3wyEJJKVQRfQUs5WxzJo&src-supplier=Analog+Devices; ComponentLink2URL: https://datasheet.octopart.com:443/MAX3485CSA%2BT-Analog-Devices-datasheet-34184623.pdf?src-supplier=Augswan; ComponentLink2Description: https://datasheet.octopart.com:443/MAX3485CSA%2BT-Analog-Devices-datasheet-34184623.pdf?src-supplier=Augswan; ComponentLink3URL: https://sigma.octopart.com:443/138901689/technical_drawing/Maxim-Integrated-MAX3485CSA%2BT.pdf?src-supplier=ShanghaiCT; ComponentLink3Description: https://sigma.octopart.com:443/138901689/technical_drawing/Maxim-Integrated-MAX3485CSA%2BT.pdf?src-supplier=ShanghaiCT; ComponentLink4URL: https://datasheet.octopart.com:443/MAX3485CSA%2BT-Maxim-Integrated-datasheet-41311393.pdf?src-supplier=Future+Electronics; ComponentLink4Description: https://datasheet.octopart.com:443/MAX3485CSA%2BT-Maxim-Integrated-datasheet-41311393.pdf?src-supplier=Future+Electronics; ComponentLink5URL: https://datasheet.octopart.com:443/MAX3485CSA%2BT-Dallas-Semiconductor-datasheet-13706444.pdf?src-supplier=_legacy+Avnet; ComponentLink5Description: https://datasheet.octopart.com:443/MAX3485CSA%2BT-Dallas-Semiconductor-datasheet-13706444.pdf?src-supplier=_legacy+Avnet; ComponentLink6URL: https://datasheet.octopart.com:443/MAX3485CSA%2BT-Maxim-Integrated-datasheet-15934920.pdf?src-supplier=iiiC; ComponentLink6Description: https://datasheet.octopart.com:443/MAX3485CSA%2BT-Maxim-Integrated-datasheet-15934920.pdf?src-supplier=iiiC; ComponentLink7URL: http://sigma.octopart.com:80/conflict_mineral_statement/Analog-Devices-company-33.pdf?src-supplier=Compliance+Statements; ComponentLink7Description: http://sigma.octopart.com:80/conflict_mineral_statement/Analog-Devices-company-33.pdf?src-supplier=Compliance+Statements; ComponentLink8URL: http://sigma.octopart.com:80/conflict_mineral_statement/Maxim-Integrated-company-65.pdf?src-supplier=Compliance+Statements; ComponentLink8Description: http://sigma.octopart.com:80/conflict_mineral_statement/Maxim-Integrated-company-65.pdf?src-supplier=Compliance+Statements; ComponentLink9URL: http://sigma.octopart.com:80/rohs_statement/Maxim-Integrated-company-66.pdf?src-supplier=Compliance+Statements; ComponentLink9Description: http://sigma.octopart.com:80/rohs_statement/Maxim-Integrated-company-66.pdf?src-supplier=Compliance+Statements; ComponentLink10URL: http://sigma.octopart.com:80/reach_statement/Maxim-Integrated-company-67.pdf?src-supplier=Compliance+Statements; ComponentLink10Description: http://sigma.octopart.com:80/reach_statement/Maxim-Integrated-company-67.pdf?src-supplier=Compliance+Statements; ComponentLink11URL: https://octopart.com:443/opatz8j6/c1?t=m64L-xaEZ2R1jTHJ7EbKIZ9zjyJB3lxESLQ1VC6iQsJY5MbBGBObpHdNd7bSPYLe07Gn7EiSNoCMl2Slv2MwzGYNSLe72vHY9ta9P4JBQ7SYxyvwYOu5ak2qyK3J8BG_FUG4bh5CA01Wiu40KnfKGmXxPZ8OY_sGsYHh19GBc4j9HpoWh0h6K6SOpDlKCNcnTG541f6pNi2nbh2bv5BwrtschXzlR3dPZe29Bu7Gy87HTYcKqfx0zsvJkCMf9_vNU9ezsKKHfu4q3hHL3LSRDZSq8kCHGmKlEkFHM2ABfU4PrTOx6jn09x2j&src-supplier=Compliance+Statements; ComponentLink11Description: https://octopart.com:443/opatz8j6/c1?t=m64L-xaEZ2R1jTHJ7EbKIZ9zjyJB3lxESLQ1VC6iQsJY5MbBGBObpHdNd7bSPYLe07Gn7EiSNoCMl2Slv2MwzGYNSLe72vHY9ta9P4JBQ7SYxyvwYOu5ak2qyK3J8BG_FUG4bh5CA01Wiu40KnfKGmXxPZ8OY_sGsYHh19GBc4j9HpoWh0h6K6SOpDlKCNcnTG541f6pNi2nbh2bv5BwrtschXzlR3dPZe29Bu7Gy87HTYcKqfx0zsvJkCMf9_vNU9ezsKKHfu4q3hHL3LSRDZSq8kCHGmKlEkFHM2ABfU4PrTOx6jn09x2j&src-supplier=Compliance+Statements; Supplier 1: DigiKey; Supplier Part Number 1: MAX3485CSA+CT-ND
U3 = LDLN030G33R: LDO Regulator Pos 3.3V 0.3A 5-Pin TSOT-23 T/R; Manufacturer: STMicroelectronics; Output Type: Fixed; Output Configuration: Positive; Number of Regulators: 1; Max Supply Voltage: 5.5V; Output Current: 300mA; Quiescent Current: 30uA; Max Supply Current: 360uA; Power Supply Rejection Ratio (PSRR): 53dB; .Date: *; Supplier: Mouser; Supplier Part Number: 511-LDLN030G33R; Manufacturer Part Number: LDLN030G33R; RoHS: Yes; Category: Voltage Regulators - Linear; Stock: 11992; Pricing: 1=0.37, 10=0.258, 50=0.23, 100=0.199, 1000=0.168, 10000=0.148 (USD); Mounting Technology: Surface Mount; Case/Package: SOT-23-5; Min Operating Temperature: -40°C; Max Operating Temperature: 125°C; Packaging: Cut Tape; Min Output Voltage: 3.3V; Series: -; Number of Channels: 1; Output Voltage: 3.3V; RoHS Compliant: Yes; ComponentLink1URL: http://www.farnell.com/datasheets/2819117.pdf?src-supplier=Farnell; ComponentLink1Description: http://www.farnell.com/datasheets/2819117.pdf?src-supplier=Farnell; ComponentLink2URL: http://www.st.com/content/ccc/resource/technical/document/datasheet/group3/17/6b/17/5d/59/ae/4b/55/DM00473388/files/DM00473388.pdf/jcr:content/translations/en.DM00473388.pdf?src-supplier=Digikey; ComponentLink2Description: http://www.st.com/content/ccc/resource/technical/document/datasheet/group3/17/6b/17/5d/59/ae/4b/55/DM00473388/files/DM00473388.pdf/jcr:content/translations/en.DM00473388.pdf?src-supplier=Digikey; ComponentLink3URL: http://www.farnell.com/datasheets/2819117.pdf?src-supplier=Newark; ComponentLink3Description: http://www.farnell.com/datasheets/2819117.pdf?src-supplier=Newark; ComponentLink4URL: https://datasheet.octopart.com/LDLN030G33R-STMicroelectronics-datasheet-103422380.pdf?src-supplier=TME; ComponentLink4Description: https://datasheet.octopart.com/LDLN030G33R-STMicroelectronics-datasheet-103422380.pdf?src-supplier=TME; Supplier 1: Mouser; Supplier Part Number 1: 511-LDLN030G33R; .Saturation Current: =Saturation Current; .Reverse Standoff Voltage: =Reverse Standoff Voltage; .Voltage Rating: =Voltage Rating; .Tolerance: =Tolerance